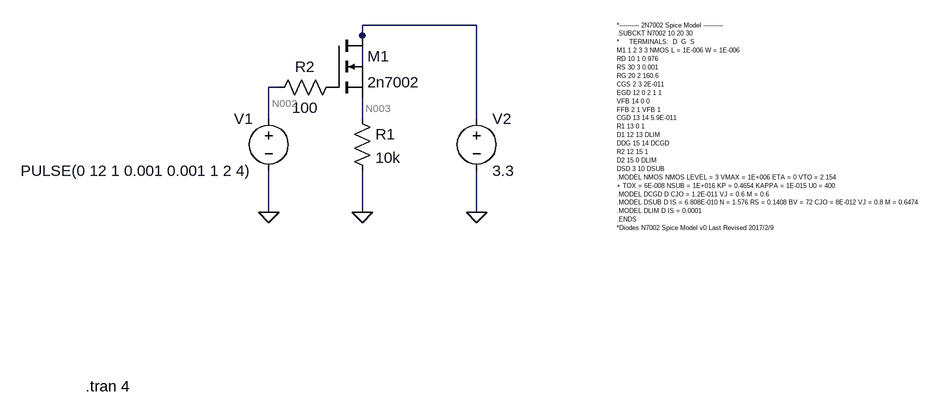
[diagram p0: schematic Level Converter.asc]
Level Converter.asc, the LTspice schematic file:
Version 4
SHEET 1 1396 680
WIRE 688 -176 512 -176
WIRE 512 -160 512 -176
WIRE 384 -80 368 -80
WIRE 512 -80 512 -160
WIRE 368 -32 368 -80
WIRE 512 -32 512 -64
WIRE 688 -32 688 -176
WIRE 368 112 368 48
WIRE 512 112 512 48
WIRE 688 112 688 48
FLAG 368 112 0
FLAG 512 112 0
FLAG 688 112 0
SYMBOL nmos 464 -160 R0
SYMATTR InstName M1
SYMATTR Value 2n7002
SYMBOL voltage 368 -48 M0
WINDOW 123 0 0 Left 0
WINDOW 39 0 0 Left 0
SYMATTR InstName V1
SYMATTR Value PULSE(0 12 1 0.001 0.001 1 2 4)
SYMBOL voltage 688 -48 R0
WINDOW 123 0 0 Left 0
WINDOW 39 0 0 Left 0
SYMATTR InstName V2
SYMATTR Value 3.3
SYMBOL res 496 -48 R0
SYMATTR InstName R1
SYMATTR Value 10k
SYMBOL res 480 -96 R90
WINDOW 0 0 56 VBottom 2
WINDOW 3 32 56 VTop 2
SYMATTR InstName R2
SYMATTR Value 100
TEXT 904 -176 Left 0 !*---------- 2N7002 Spice Model ----------\n.SUBCKT N7002 10 20 30 \n*     TERMINALS:  D  G  S\nM1 1 2 3 3 NMOS L = 1E-006 W = 1E-006 \nRD 10 1 0.976 \nRS 30 3 0.001 \nRG 20 2 160.6 \nCGS 2 3 2E-011 \nEGD 12 0 2 1 1 \nVFB 14 0 0 \nFFB 2 1 VFB 1 \nCGD 13 14 5.9E-011 \nR1 13 0 1 \nD1 12 13 DLIM \nDDG 15 14 DCGD \nR2 12 15 1 \nD2 15 0 DLIM \nDSD 3 10 DSUB \n.MODEL NMOS NMOS LEVEL = 3 VMAX = 1E+006 ETA = 0 VTO = 2.154 \n+ TOX = 6E-008 NSUB = 1E+016 KP = 0.4654 KAPPA = 1E-015 U0 = 400 \n.MODEL DCGD D CJO = 1.2E-011 VJ = 0.6 M = 0.6 \n.MODEL DSUB D IS = 6.808E-010 N = 1.576 RS = 0.1408 BV = 72 CJO = 8E-012 VJ = 0.8 M = 0.6474 \n.MODEL DLIM D IS = 0.0001 \n.ENDS\n*Diodes N7002 Spice Model v0 Last Revised 2017/2/9
TEXT 86 380 Left 2 !.tran 4

The netlist it stands for:
* Level Converter.asc
M1 N001 P001 N003 N003 2n7002
V1 N002 0 PULSE(0 12 1 0.001 0.001 1 2 4)
V2 N001 0 3.3
R1 N003 0 10k
R2 P001 N002 100
.model NMOS NMOS
.model PMOS PMOS
.lib standard.mos
*---------- 2N7002 Spice Model ----------
.SUBCKT N7002 10 20 30
*     TERMINALS:  D  G  S
M1 1 2 3 3 NMOS L = 1E-006 W = 1E-006
RD 10 1 0.976
RS 30 3 0.001
RG 20 2 160.6
CGS 2 3 2E-011
EGD 12 0 2 1 1
VFB 14 0 0
FFB 2 1 VFB 1
CGD 13 14 5.9E-011
R1 13 0 1
D1 12 13 DLIM
DDG 15 14 DCGD
R2 12 15 1
D2 15 0 DLIM
DSD 3 10 DSUB
.MODEL NMOS NMOS LEVEL = 3 VMAX = 1E+006 ETA = 0 VTO = 2.154
+ TOX = 6E-008 NSUB = 1E+016 KP = 0.4654 KAPPA = 1E-015 U0 = 400
.MODEL DCGD D CJO = 1.2E-011 VJ = 0.6 M = 0.6
.MODEL DSUB D IS = 6.808E-010 N = 1.576 RS = 0.1408 BV = 72 CJO = 8E-012 VJ = 0.8 M = 0.6474
.MODEL DLIM D IS = 0.0001
.ENDS
*Diodes N7002 Spice Model v0 Last Revised 2017/2/9
.tran 4
.backanno
.end

* Results of the author's LTspice run, read from the files saved beside the schematic
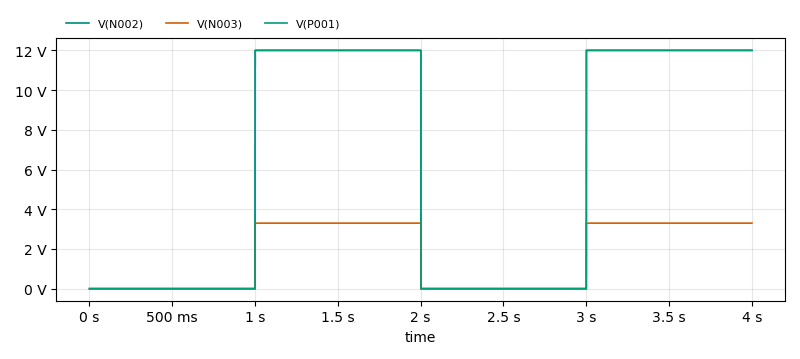
[diagram p1: Transient Analysis of Level Converter.asc, plotted from the saved traces]
* Transient Analysis, 1 run:
*   V(N002): min 0 V, max 12 V, average 6.002 V, rms 8.485 V, last 12 V
*   V(N003): min -7.117 mV, max 3.3 V, average 1.651 V, rms 2.334 V, last 3.3 V
*   V(P001): min 0 V, max 12 V, average 6.001 V, rms 8.485 V, last 12 V